# EAGLE schematic stm32hw03 (EAGLE 6.6.0)
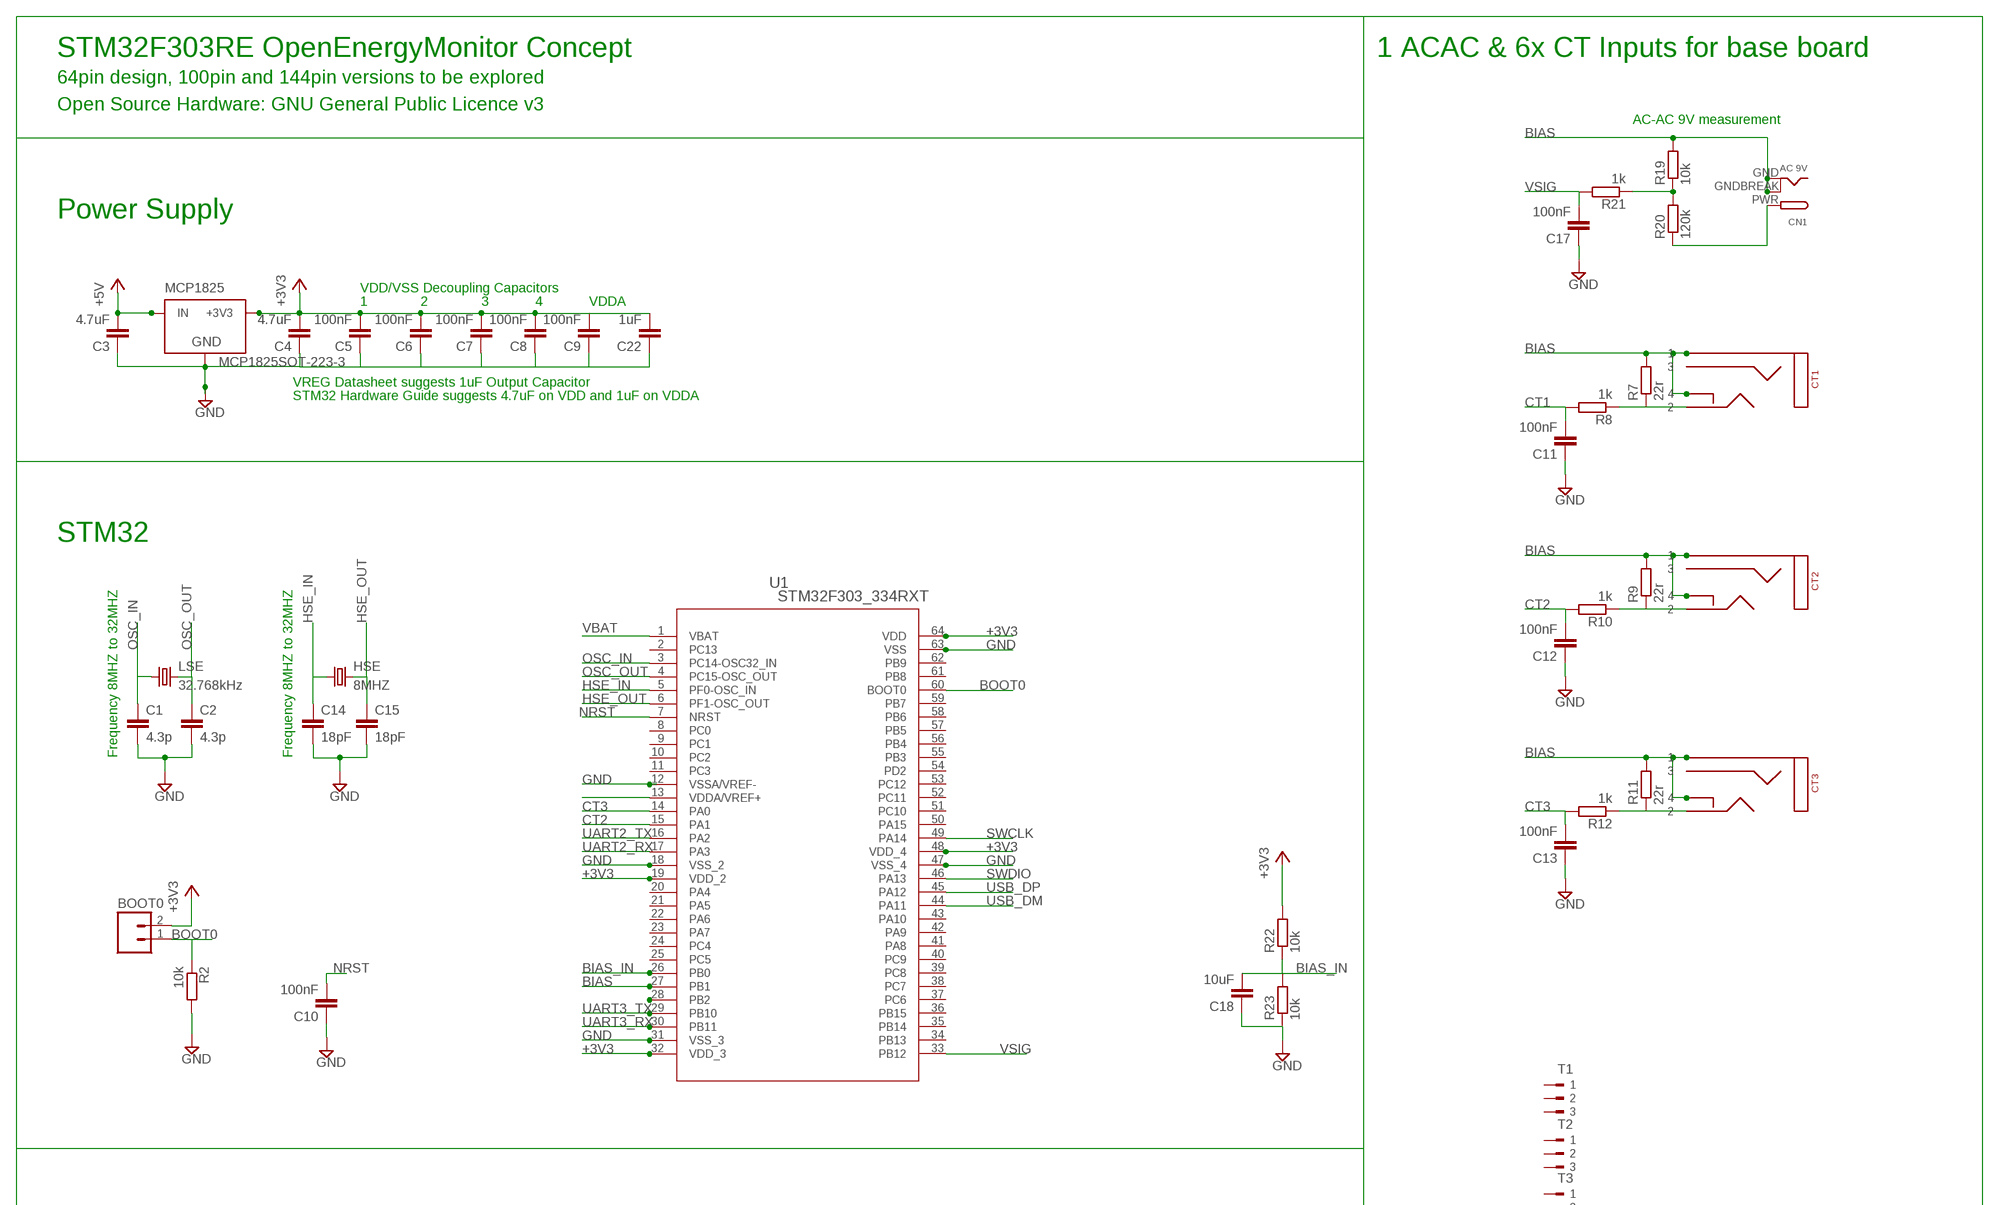
[diagram p0: schematic, sheet 1, part 1 of 2]
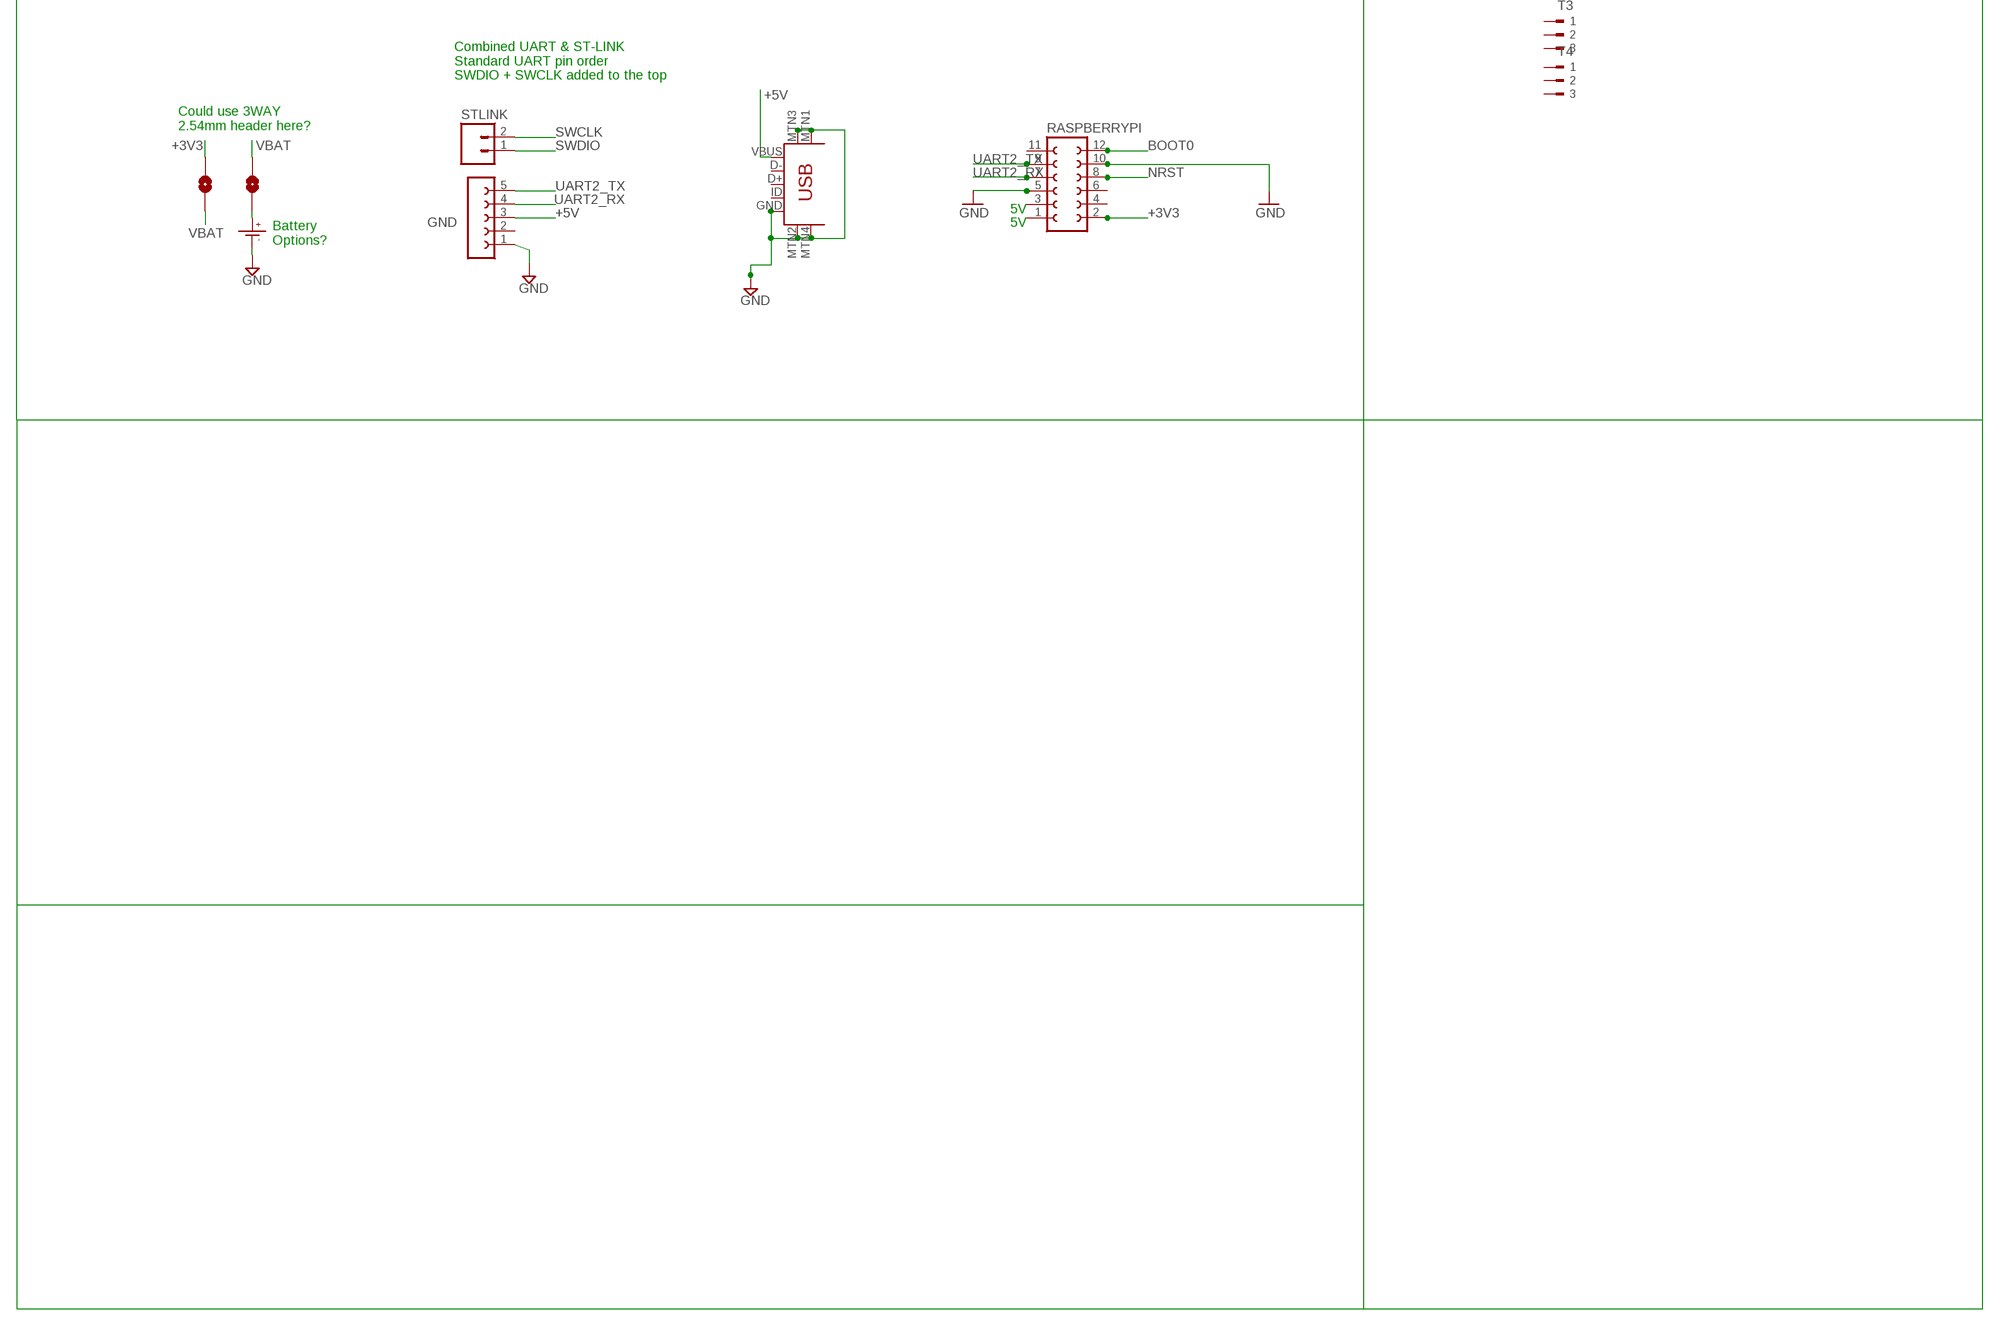
[diagram p1: schematic, sheet 1, part 2 of 2]

## Parts
3V3  SOLDERJUMPERNO  [SJ_2S-NO]
BATTERY  SOLDERJUMPERNO  [SJ_2S-NO]
BOOT0  M02PTH  [1X02]
C1  4.3p  C-EUC0603  [C0603]
C2  4.3p  C-EUC0603  [C0603]
C3  4.7uF  C-EUC0603  [C0603]
C4  4.7uF  C-EUC0603  [C0603]
C5  100nF  C-EUC0603  [C0603]
C6  100nF  C-EUC0603  [C0603]
C7  100nF  C-EUC0603  [C0603]
C8  100nF  C-EUC0603  [C0603]
C9  100nF  C-EUC0603  [C0603]
C10  100nF  C-EUC0603  [C0603]
C11  100nF  C-EUC0603  [C0603]
C12  100nF  C-EUC0603  [C0603]
C13  100nF  C-EUC0603  [C0603]
C14  18pF  C-EUC0603  [C0603]
C15  18pF  C-EUC0603  [C0603]
C17  100nF  C-EUC0603  [C0603]
C18  10uF  C-EUC0603  [C0603]
C22  1uF  C-EUC0603  [C0603]
CN1  AC 9V  DCBARRELPTH  [DCJACK_2MM_PTH]
CR1220  CR1220SMD  [CR1220SMD]
CT1  STEREO_SMD  [STEREO_SMT]
CT2  STEREO_SMD  [STEREO_SMT]
CT3  STEREO_SMD  [STEREO_SMT]
GND  UART  FE05-1  [FE05-1]
HSE  8MHZ  CRYSTALCTS406  [CTS406]
LSE  32.768kHz  MC-306  [MC-306]
MCP1825  MCP1825SOT-223-3  [SOT-223]
R2  10k  R-EU_R0603  [R0603]
R7  22r  R-EU_R0603  [R0603]
R8  1k  R-EU_R0603  [R0603]
R9  22r  R-EU_R0603  [R0603]
R10  1k  R-EU_R0603  [R0603]
R11  22r  R-EU_R0603  [R0603]
R12  1k  R-EU_R0603  [R0603]
R19  10k  R-EU_R0603  [R0603]
R20  120k  R-EU_R0603  [R0603]
R21  1k  R-EU_R0603  [R0603]
R22  10k  R-EU_R0603  [R0603]
R23  10k  R-EU_R0603  [R0603]
RASPBERRYPI  FE06-2  [FE06-2]
STLINK  M02PTH  [1X02]
T1  180-3  [180-3]
T2  180-3  [180-3]
T3  180-3  [180-3]
T4  180-3  [180-3]
U1  STM32F303_334RXT  [LQFP64-10X10MM]
U$10  USB-MINIB-5PIN  [USB-MINIB-CISECO]

## Nets
+3V3: 3V3.1 BOOT0.2 C4.2 C5.2 C6.2 C7.2 C8.2 C9.2 C22.2 MCP1825.3(+3V3) R22.2 RASPBERRYPI.2 U1.13(VDDA/VREF+) U1.19(VDD_2) U1.32(VDD_3) U1.48(VDD_4) U1.64(VDD)
+5V: C3.2 GND.3 MCP1825.1(IN) U$10.VBUS
AC: CN1.PWR R20.1
ADC0: R19.1 R20.2 R21.1
BIAS: CN1.GND CN1.GNDBREAK CT1.P$1 CT1.P$4 CT2.P$1 CT2.P$4 CT3.P$1 CT3.P$4 R7.2 R9.2 R11.2 R19.2 U1.27(PB1)
BIAS_IN: C18.2 R22.1 R23.2 U1.26(PB0)
BOOT0: BOOT0.1 R2.1 RASPBERRYPI.12 U1.60(BOOT0)
CT1: C11.2 R8.2
CT2: C12.2 R10.2 U1.15(PA1)
CT3: C13.2 R12.2 U1.14(PA0)
GND: C1.2 C2.2 C3.1 C4.1 C5.1 C6.1 C7.1 C8.1 C9.1 C10.1 C11.1 C12.1 C13.1 C14.2 C15.2 C17.1 C18.1 C22.1 CR1220.P-(P$-) GND.1 MCP1825.2(GND) R2.2 R23.1 RASPBERRYPI.5 RASPBERRYPI.10 U1.12(VSSA/VREF-) U1.18(VSS_2) U1.31(VSS_3) U1.47(VSS_4) U1.63(VSS) U$10.GND U$10.MTN1(MTN2) U$10.MTN2(MTN3) U$10.MTN3(MTN1) U$10.MTN4
HSE_IN: C14.1 HSE.1 U1.5(PF0-OSC_IN)
HSE_OUT: C15.1 HSE.3 U1.6(PF1-OSC_OUT)
N$1: BATTERY.2 CR1220.P+(P$+)
N$2: CT1.P$2 R7.1 R8.1
N$6: U1.28(PB2)
N$8: CT2.P$2 R9.1 R10.1
N$10: CT3.P$2 R11.1 R12.1
NRST: C10.2 RASPBERRYPI.8 U1.7(NRST)
OSC_IN: C1.1 LSE.1 U1.3(PC14-OSC32_IN)
OSC_OUT: C2.1 LSE.4 U1.4(PC15-OSC_OUT)
SWCLK: STLINK.2 U1.49(PA14)
SWDIO: STLINK.1 U1.46(PA13)
UART2_RX: GND.4 RASPBERRYPI.7 U1.17(PA3)
UART2_TX: GND.5 RASPBERRYPI.9 U1.16(PA2)
UART3_RX: U1.30(PB11)
UART3_TX: U1.29(PB10)
USB_DM: U1.44(PA11)
USB_DP: U1.45(PA12)
VBAT: 3V3.2 BATTERY.1 U1.1(VBAT)
VSIG: C17.2 R21.2 U1.33(PB12)
Unconnected: CT1.P$3 CT2.P$3 CT3.P$3 GND.2 RASPBERRYPI.1 RASPBERRYPI.3 RASPBERRYPI.4 RASPBERRYPI.6 RASPBERRYPI.11 T1.1 T1.2 T1.3 T2.1 T2.2 T2.3 T3.1 T3.2 T3.3 T4.1 T4.2 T4.3 U1.2(PC13) U1.8(PC0) U1.9(PC1) U1.10(PC2) U1.11(PC3) U1.20(PA4) U1.21(PA5) U1.22(PA6) U1.23(PA7) U1.24(PC4) U1.25(PC5) U1.34(PB13) U1.35(PB14) U1.36(PB15) U1.37(PC6) U1.38(PC7) U1.39(PC8) U1.40(PC9) U1.41(PA8) U1.42(PA9) U1.43(PA10) U1.50(PA15) U1.51(PC10) U1.52(PC11) U1.53(PC12) U1.54(PD2) U1.55(PB3) U1.56(PB4) U1.57(PB5) U1.58(PB6) U1.59(PB7) U1.61(PB8) U1.62(PB9) U$10.D+ U$10.D- U$10.ID

## Notes on the sheet
- STM32F303RE OpenEnergyMonitor Concept | 1 ACAC & 6x CT Inputs for base board
- 64pin design, 100pin and 144pin versions to be explored
- Open Source Hardware: GNU General Public Licence v3
- AC-AC 9V measurement
- Power Supply
- VDD/VSS Decoupling Capacitors
- 1 | 2 | 3 | 4 | VDDA
- VREG Datasheet suggests 1uF Output Capacitor
- STM32 Hardware Guide suggests 4.7uF on VDD and 1uF on VDDA
- STM32
- Frequency 8MHZ to 32MHZ | Frequency 8MHZ to 32MHZ
- Combined UART & ST-LINK
  Standard UART pin order
  SWDIO + SWCLK added to the top
- Could use 3WAY
  2.54mm header here?
- 5V
- 5V
- Battery
  Options?

## Library data of the parts
3V3 BATTERY = SparkFun:SOLDERJUMPER: Solder Jumper Standard SMD solder jumper. Used to automate production. Two varients : Normally Open and Normally Closed are the same, but have different paste layers. NC will have a large amount of paste and should jumper during reflow.
BOOT0 STLINK = SparkFun:M02: Header 2 Standard 2-pin 0.1" header. Use with straight break away headers (SKU : PRT-00116), right angle break away headers (PRT-00553), swiss pins (PRT-00743), machine pins (PRT-00117), and female headers (PRT-00115). Molex polarized connector foot print use with SKU : PRT-08233 with associated crimp pins and housings.
C1-C15 C17 C18 C22 = resistor:C-EU: CAPACITOR, European symbol
CN1 = adafruit:DCBARREL: 2.0mm DC Barrel Jack DCJACK_2MM_PTH - Through Hole Jack (4UConnector: 05537)
CR1220 = IotaWatt_parts:CR1220SMD: CR1220 Battery SMD; MPN: Harwin S8411-45R
CT1-CT3 = IotaWatt_parts:STEREO_SMD: 3.5mm Stereo Jack SMT
GND = con-lsta:FE05-1: FEMALE HEADER; OC_FARNELL: unknown; OC_NEWARK: unknown
HSE = crystal:CRYSTAL: CRYSTAL; OC_FARNELL: unknown; OC_NEWARK: unknown
LSE = crystal:MC-306: kHz RANGE CRYSTAL UNIT SMD Source: MC-306_405_406_E07X.PDF Homepage <http://www.epsontoyocom.co.jp>; MPN: MC-306 60.0KHZ 100PPM ,12.5PF; OC_FARNELL: 1278040; OC_NEWARK: 31M5576
MCP1825 = SteelCaveRobotics-Power:MCP1825: MCP1825 3.3v LDO Linear Regulator
R2 R7-R12 R19-R23 = resistor:R-EU_: RESISTOR, European symbol
RASPBERRYPI = con-lsta:FE06-2: FEMALE HEADER; OC_FARNELL: unknown; OC_NEWARK: unknown
T1-T4 = con-weidmueller-sl35:180-3: WEIDMUELLER CLAMP CONNECTOR; OC_FARNELL: unknown; OC_NEWARK: unknown
U1 = stm32f303:STM32F303_334RXT; MANUFACTURER_PART_NUMBER: stm32f303_334rxt; VENDOR: STMicroelectronics
U$10 = Ciseco USB miniB_Updated:USB-MINIB: Mini-USB "B" connector with 5th pin broken out. Created new symbol breaking out 5th "ID" pin in mini/micro USB connector spec. See: http://en.wikipedia.org/wiki/Mini_usb#Cables. Uses same footprint as 4-pin symbol. Also added pins to connect to mounting / shield pads if required (probably not generally needed as signals aren't shielded once they leave the connector). Modified by Ciseco for Rapid Part 24-0357

## Net classes
0 default: width 0.203 mm, drill 0.6 mm, clearance 0.203 mm
1 power: width 0.381 mm, drill 0.6 mm, clearance 0.254 mm
2 gnd: width 0.254 mm, drill 0.6 mm, clearance 0.254 mm